# EAGLE schematic SNAC  7ch SNES in Housing (EAGLE 9.0.1)
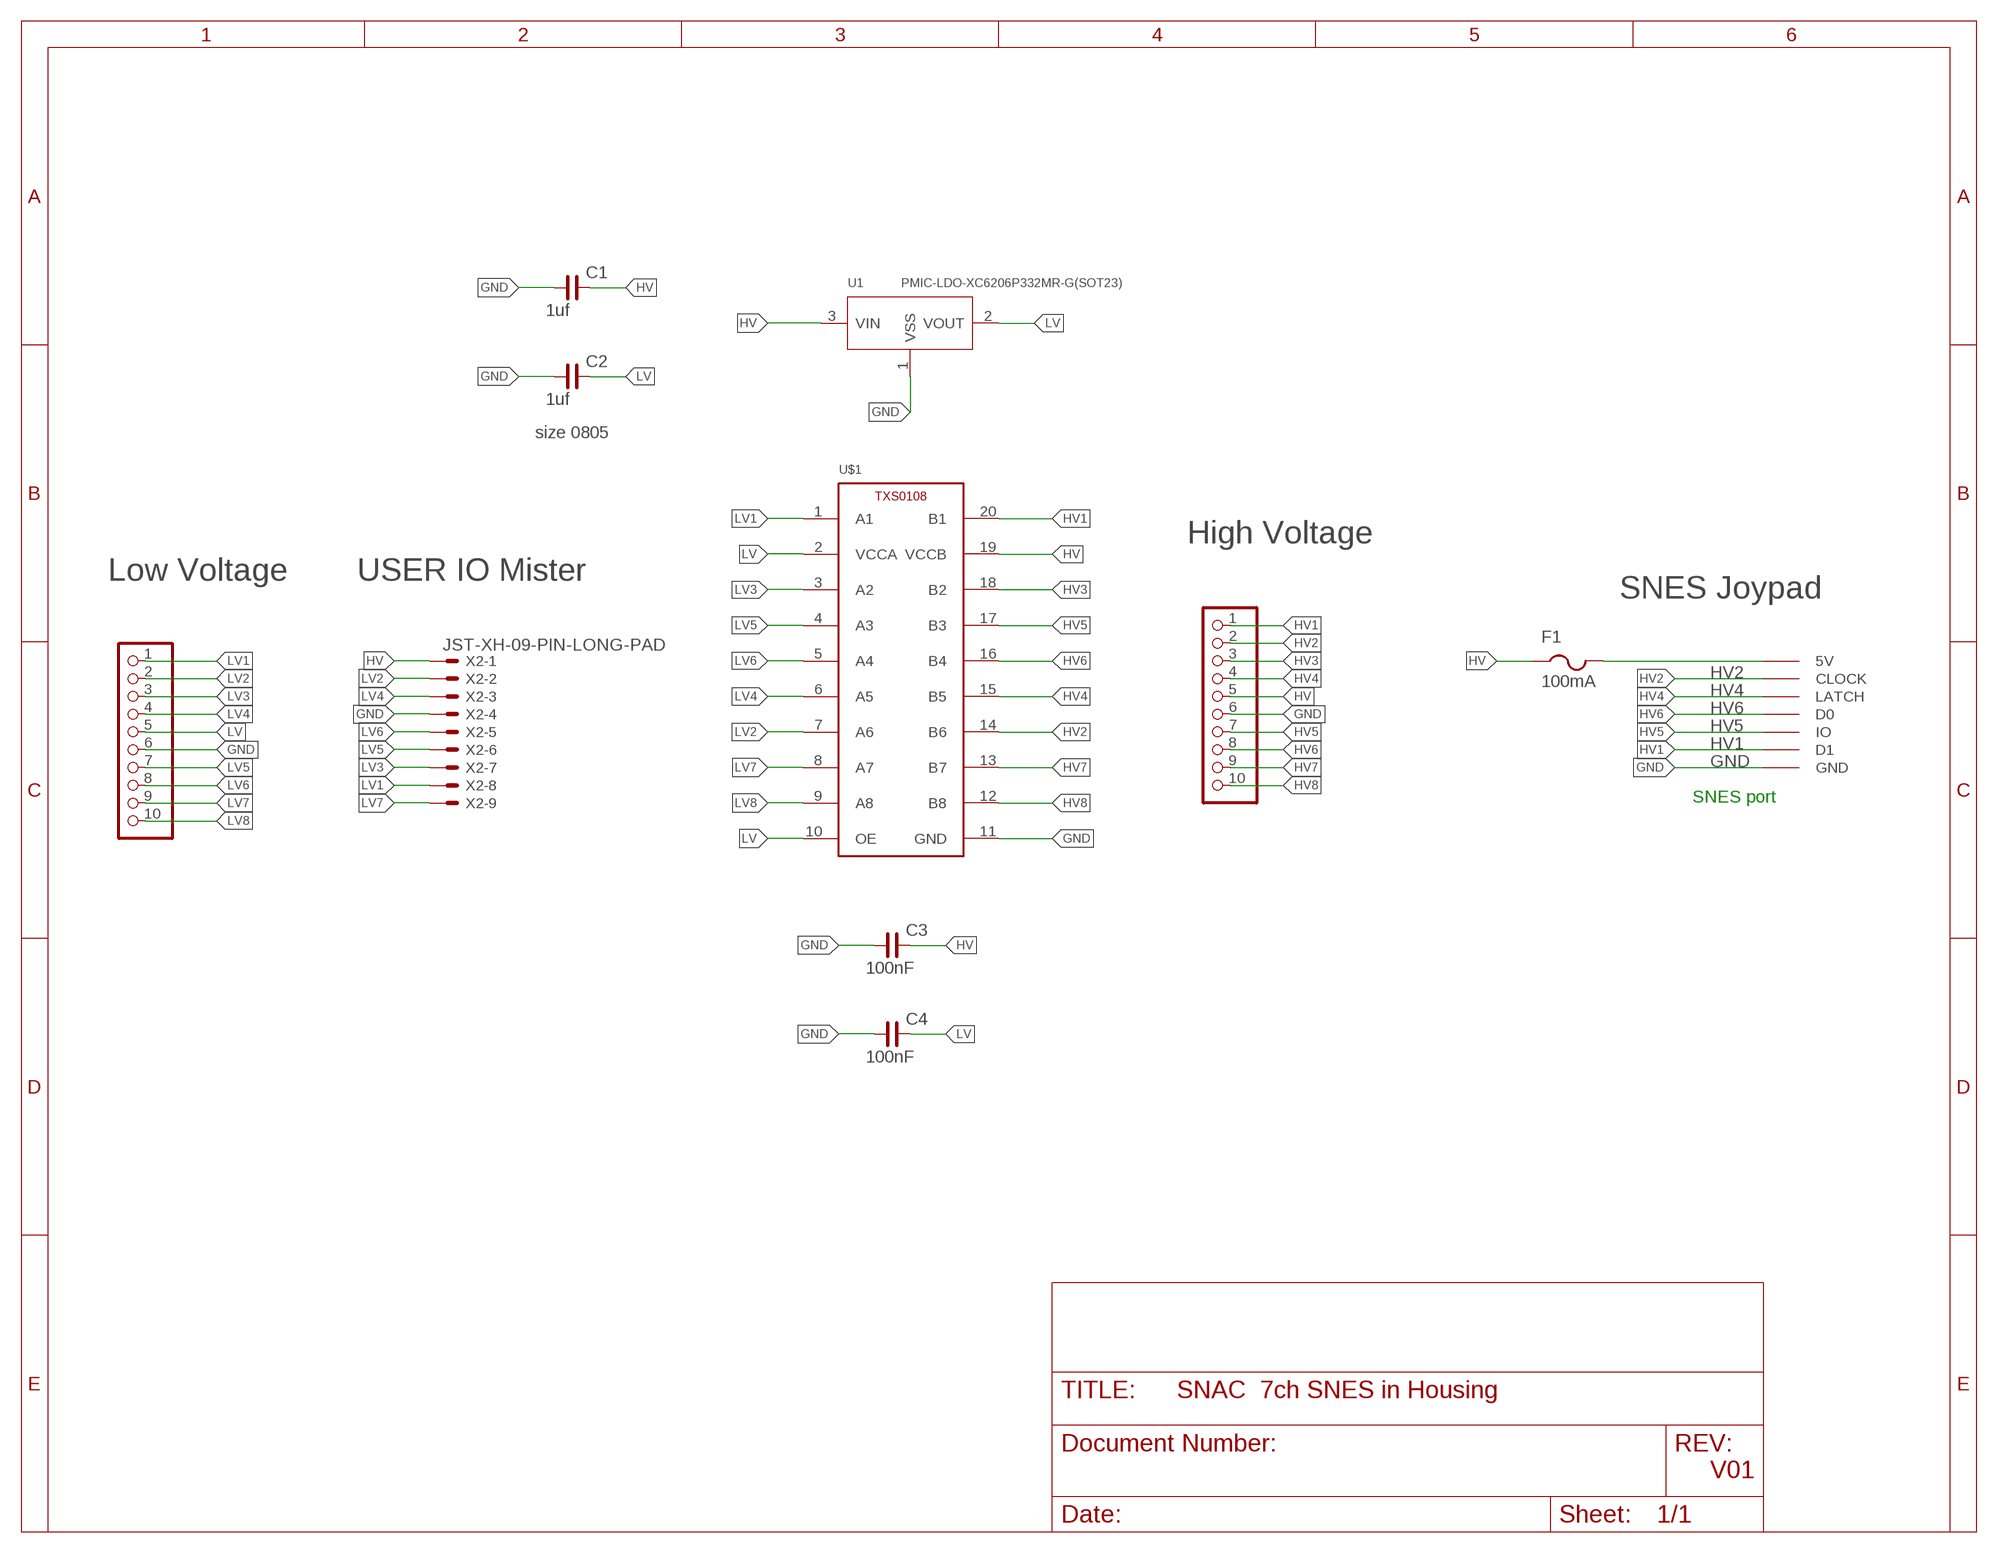
[diagram p0: schematic, sheet 1]

## Parts
C1  1uf  C_0805  [C0805]
C2  1uf  C_0805  [C0805]
C3  100nF  C_0805  [C0805]
C4  100nF  C_0805  [C0805]
F1  100mA  PTCFUSE-1206  [R1206]
JP1  PINHD-1X10_2.54-S  [1X10-S]
JP2  PINHD-1X10_2.54-S  [1X10-S]
U1  PMIC-LDO-XC6206P332MR-G(SOT23)  [SOT-23]
U$1  TXS0108  [R-PUSON-N20]
U$3  SNESCONN  [SNESCONN]
X2  JST-XH-09-PIN-LONG-PAD  [JST-XH-09-PACKAGE-LONG-PAD]

## Nets
GND: C1.1 C2.1 C3.1 C4.1 JP1.6 JP2.6 U1.1(VSS) U$1.11(GND) U$3.GND X2.4
HV: C1.2 C3.2 F1.1 JP2.5 U1.3(VIN) U$1.19(VCCB) X2.1
HV1: JP2.1 U$1.20(B1) U$3.D1
HV2: JP2.2 U$1.14(B6) U$3.CLOCK
HV3: JP2.3 U$1.18(B2)
HV4: JP2.4 U$1.15(B5) U$3.LATCH
HV5: JP2.7 U$1.17(B3) U$3.IO
HV6: JP2.8 U$1.16(B4) U$3.D0
HV7: JP2.9 U$1.13(B7)
HV8: JP2.10 U$1.12(B8)
LV: C2.2 C4.2 JP1.5 U1.2(VOUT) U$1.2(VCCA) U$1.10(OE)
LV1: JP1.1 U$1.1(A1) X2.8
LV2: JP1.2 U$1.7(A6) X2.2
LV3: JP1.3 U$1.3(A2) X2.7
LV4: JP1.4 U$1.6(A5) X2.3
LV5: JP1.7 U$1.4(A3) X2.6
LV6: JP1.8 U$1.5(A4) X2.5
LV7: JP1.9 X2.9
LV8: JP1.10 U$1.9(A8)
N$5: F1.2 U$3.5V
N$6: U$1.8(A7)

## Notes on the sheet
- size 0805
- High Voltage
- Low Voltage | USER IO Mister
- SNES Joypad
- SNES port
- V01

## Library data of the parts
C1-C4 = rc-master-smd:C_: NON-POLARIZED CAP
F1 = adafruit:PTCFUSE: PTC fuses, resettable thermistors
JP1 JP2 = pinhead-2:PINHD-1X10: PIN HEADER
U1 = PMIC-LDO-XC6206P332MR-G_SOT23_:PMIC-LDO-XC6206P332MR-G(SOT23): 310030099; AVAILABILITY: Unavailable; DESCRIPTION: SMD PMIC; LDO; Vin 6V; 3.3V; 200mA; Without En; 1-Ch; MF: Torex; MP: XC6206P332MR-G; PACKAGE: SOT-23-3 Torex; PRICE: None
U$1 = FaBo-LevelTranslator:TXS0108
U$3 = gamepad-conn:SNESCONN
X2 = Rembrandt Electronics - JST XH Connectors v1-0:JST-XH-09-PIN: JST XH Connector 2 Pin Wire to board connector. Pitch: 2,54 mm, (0.100") Number of pins: 9 Created by Rembrandt Electronics www.rembrandtelectronics.com